# EAGLE design ThermoActuator-v10 (EAGLE 7.1.0)
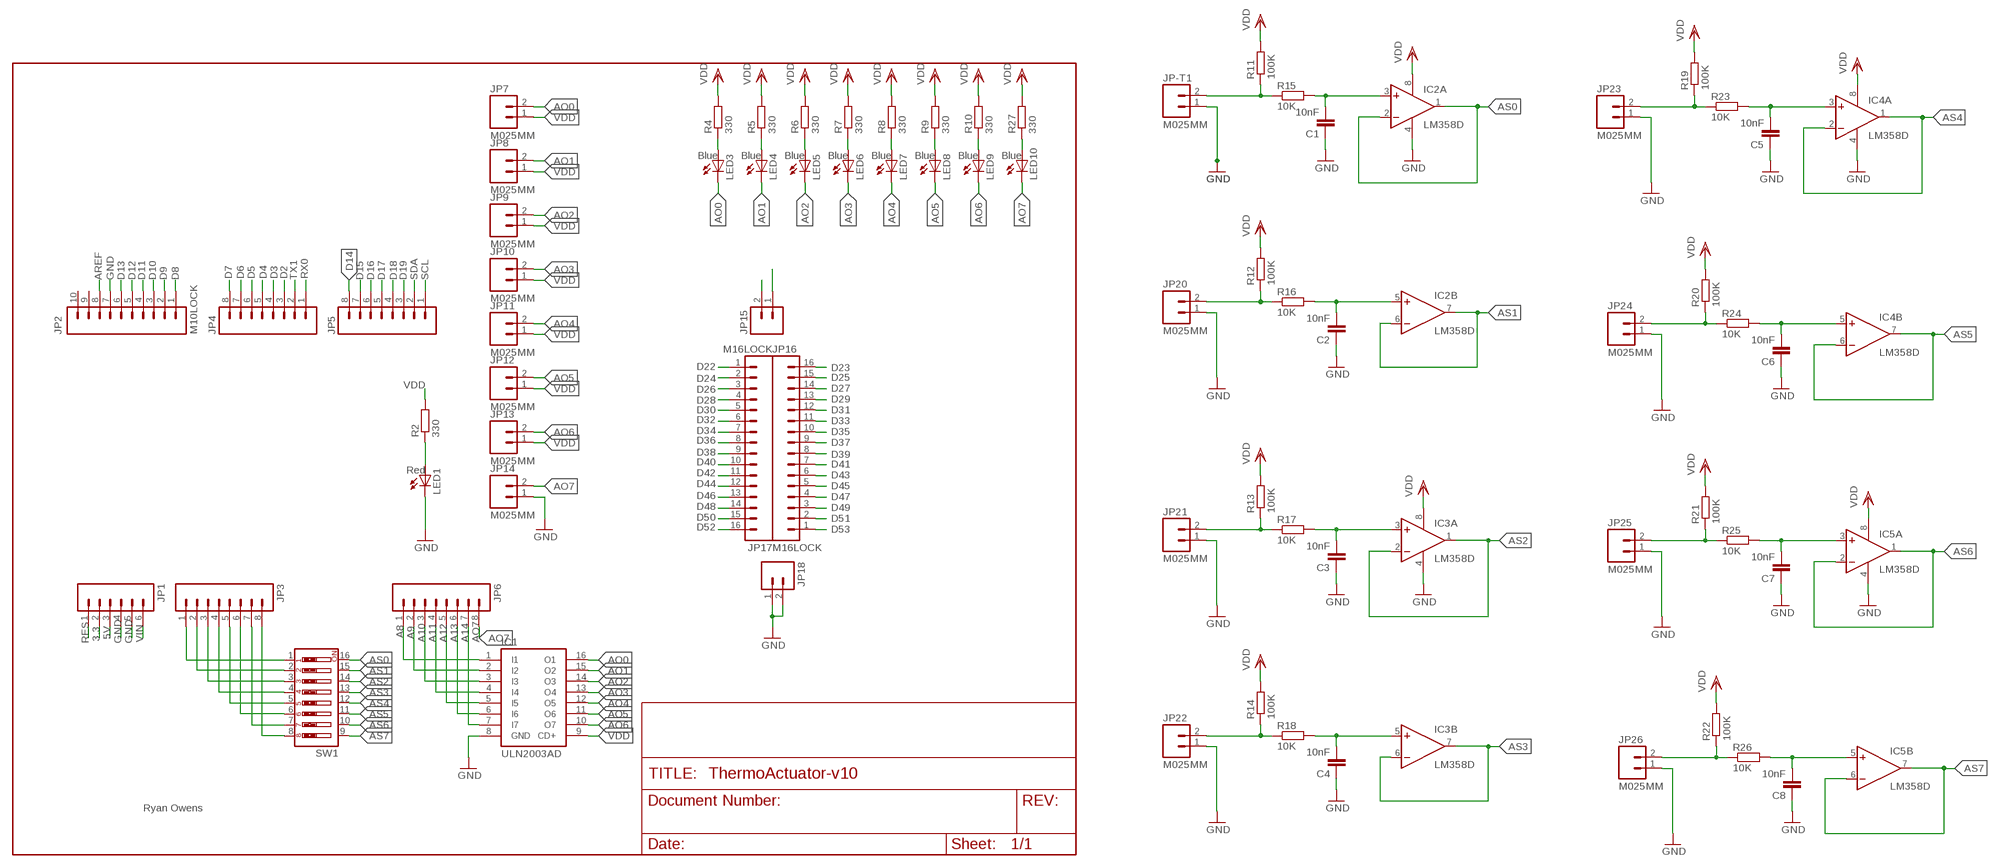
[diagram p0: schematic, sheet 1]

## Parts
C1  10nF  C-EUC1206  [C1206]
C2  10nF  C-EUC1206  [C1206]
C3  10nF  C-EUC1206  [C1206]
C4  10nF  C-EUC1206  [C1206]
C5  10nF  C-EUC1206  [C1206]
C6  10nF  C-EUC1206  [C1206]
C7  10nF  C-EUC1206  [C1206]
C8  10nF  C-EUC1206  [C1206]
IC1  ULN2003AD  [SO16]
IC2  LM358D  [SO08]
IC3  LM358D  [SO08]
IC4  LM358D  [SO08]
IC5  LM358D  [SO08]
JP1  M06LOCK  [1X06_LOCK]
JP2  M10LOCK  [1X10_LOCK]
JP3  M08LOCK  [1X08_LOCK]
JP4  M08LOCK  [1X08_LOCK]
JP5  M08LOCK  [1X08_LOCK]
JP6  M08LOCK  [1X08_LOCK]
JP7  M025MM  [SCREWTERMINAL-5MM-2]
JP8  M025MM  [SCREWTERMINAL-5MM-2]
JP9  M025MM  [SCREWTERMINAL-5MM-2]
JP10  M025MM  [SCREWTERMINAL-5MM-2]
JP11  M025MM  [SCREWTERMINAL-5MM-2]
JP12  M025MM  [SCREWTERMINAL-5MM-2]
JP13  M025MM  [SCREWTERMINAL-5MM-2]
JP14  M025MM  [SCREWTERMINAL-5MM-2]
JP15  M02LOCK  [1X02_LOCK]
JP16  M16LOCK  [1X16_LOCK]
JP17  M16LOCK  [1X16_LOCK]
JP18  M02LOCK  [1X02_LOCK]
JP20  M025MM  [SCREWTERMINAL-5MM-2]
JP21  M025MM  [SCREWTERMINAL-5MM-2]
JP22  M025MM  [SCREWTERMINAL-5MM-2]
JP23  M025MM  [SCREWTERMINAL-5MM-2]
JP24  M025MM  [SCREWTERMINAL-5MM-2]
JP25  M025MM  [SCREWTERMINAL-5MM-2]
JP26  M025MM  [SCREWTERMINAL-5MM-2]
JP-T1  M025MM  [SCREWTERMINAL-5MM-2]
LED1  Red  LEDCHIP-LED0805  [CHIP-LED0805]
LED3  Blue  LEDCHIP-LED0805  [CHIP-LED0805]
LED4  Blue  LEDCHIP-LED0805  [CHIP-LED0805]
LED5  Blue  LEDCHIP-LED0805  [CHIP-LED0805]
LED6  Blue  LEDCHIP-LED0805  [CHIP-LED0805]
LED7  Blue  LEDCHIP-LED0805  [CHIP-LED0805]
LED8  Blue  LEDCHIP-LED0805  [CHIP-LED0805]
LED9  Blue  LEDCHIP-LED0805  [CHIP-LED0805]
LED10  Blue  LEDCHIP-LED0805  [CHIP-LED0805]
R2  330  R-EU_R0805  [R0805]
R4  330  R-EU_R0805  [R0805]
R5  330  R-EU_R0805  [R0805]
R6  330  R-EU_R0805  [R0805]
R7  330  R-EU_R0805  [R0805]
R8  330  R-EU_R0805  [R0805]
R9  330  R-EU_R0805  [R0805]
R10  330  R-EU_R0805  [R0805]
R11  100K  R-EU_R0805  [R0805]
R12  100K  R-EU_R0805  [R0805]
R13  100K  R-EU_R0805  [R0805]
R14  100K  R-EU_R0805  [R0805]
R15  10K  R-EU_R1206  [R1206]
R16  10K  R-EU_R1206  [R1206]
R17  10K  R-EU_R1206  [R1206]
R18  10K  R-EU_R1206  [R1206]
R19  100K  R-EU_R0805  [R0805]
R20  100K  R-EU_R0805  [R0805]
R21  100K  R-EU_R0805  [R0805]
R22  100K  R-EU_R0805  [R0805]
R23  10K  R-EU_R1206  [R1206]
R24  10K  R-EU_R1206  [R1206]
R25  10K  R-EU_R1206  [R1206]
R26  10K  R-EU_R1206  [R1206]
R27  330  R-EU_R0805  [R0805]
SW1  SW_DIP-8  [EDG-08]

## Nets
3.3: JP1.2
5V: JP1.3
A8: IC1.1(I1) JP6.1
A9: IC1.2(I2) JP6.2
A10: IC1.3(I3) JP6.3
A11: IC1.4(I4) JP6.4
A12: IC1.5(I5) JP6.5
A13: IC1.6(I6) JP6.6
A14: IC1.7(I7) JP6.7
AO0: IC1.16(O1) JP7.2 LED3.C
AO1: IC1.15(O2) JP8.2 LED4.C
AO2: IC1.14(O3) JP9.2 LED5.C
AO3: IC1.13(O4) JP10.2 LED6.C
AO4: IC1.12(O5) JP11.2 LED7.C
AO5: IC1.11(O6) JP12.2 LED8.C
AO6: IC1.10(O7) JP13.2 LED9.C
AO7: JP6.8 JP14.2 LED10.C
AREF: JP2.8
AS0: IC2.1(A:OUT) IC2.2(A:-IN) SW1.16
AS1: IC2.6(B:-IN) IC2.7(B:OUT) SW1.15
AS2: IC3.1(A:OUT) IC3.2(A:-IN) SW1.14
AS3: IC3.6(B:-IN) IC3.7(B:OUT) SW1.13
AS4: IC4.1(A:OUT) IC4.2(A:-IN) SW1.12
AS5: IC4.6(B:-IN) IC4.7(B:OUT) SW1.11
AS6: IC5.1(A:OUT) IC5.2(A:-IN) SW1.10
AS7: IC5.6(B:-IN) IC5.7(B:OUT) SW1.9
D2: JP4.3
D3: JP4.4
D4: JP4.5
D5: JP4.6
D6: JP4.7
D7: JP4.8
D8: JP2.1
D9: JP2.2
D10: JP2.3
D11: JP2.4
D12: JP2.5
D13: JP2.6
D14: JP5.8
D15: JP5.7
D16: JP5.6
D17: JP5.5
D18: JP5.4
D19: JP5.3
D22: JP17.1
D23: JP16.16
D24: JP17.2
D25: JP16.15
D26: JP17.3
D27: JP16.14
D28: JP17.4
D29: JP16.13
D30: JP17.5
D31: JP16.12
D32: JP17.6
D33: JP16.11
D34: JP17.7
D35: JP16.10
D36: JP17.8
D37: JP16.9
D38: JP17.9
D39: JP16.8
D40: JP17.10
D41: JP16.7
D42: JP17.11
D43: JP16.6
D44: JP17.12
D45: JP16.5
D46: JP17.13
D47: JP16.4
D48: JP17.14
D49: JP16.3
D50: JP17.15
D51: JP16.2
D52: JP17.16
D53: JP16.1
GND: C1.1 C2.1 C3.1 C4.1 C5.1 C6.1 C7.1 C8.1 IC1.8(GND) IC2.4(P:V-) IC3.4(P:V-) IC4.4(P:V-) IC5.4(P:V-) JP1.4 JP1.5 JP2.7 JP14.1 JP18.1 JP18.2 JP20.1 JP21.1 JP22.1 JP23.1 JP24.1 JP25.1 JP26.1 JP-T1.1 LED1.C
N$1: JP-T1.2 R11.1 R15.1
N$2: C1.2 IC2.3(A:+IN) R15.2
N$3: JP3.1 SW1.1
N$4: JP3.2 SW1.2
N$5: JP3.3 SW1.3
N$6: JP3.4 SW1.4
N$7: JP3.5 SW1.5
N$8: JP3.6 SW1.6
N$9: JP3.7 SW1.7
N$10: JP3.8 SW1.8
N$11: JP20.2 R12.1 R16.1
N$12: C2.2 IC2.5(B:+IN) R16.2
N$13: LED3.A R4.1
N$14: LED4.A R5.1
N$15: LED5.A R6.1
N$16: LED6.A R7.1
N$17: LED7.A R8.1
N$18: LED8.A R9.1
N$19: LED9.A R10.1
N$20: JP21.2 R13.1 R17.1
N$21: C3.2 IC3.3(A:+IN) R17.2
N$22: JP22.2 R14.1 R18.1
N$23: C4.2 IC3.5(B:+IN) R18.2
N$24: JP23.2 R19.1 R23.1
N$25: C5.2 IC4.3(A:+IN) R23.2
N$26: JP24.2 R20.1 R24.1
N$27: C6.2 IC4.5(B:+IN) R24.2
N$28: JP25.2 R21.1 R25.1
N$29: C7.2 IC5.3(A:+IN) R25.2
N$30: JP26.2 R22.1 R26.1
N$31: C8.2 IC5.5(B:+IN) R26.2
N$32: LED10.A R27.1
N$126: LED1.A R2.1
RES: JP1.1
RX0: JP4.1
SCL: JP5.1
SDA: JP5.2
TX1: JP4.2
VDD: IC1.9(CD+) IC2.8(P:V+) IC3.8(P:V+) IC4.8(P:V+) IC5.8(P:V+) JP7.1 JP8.1 JP9.1 JP10.1 JP11.1 JP12.1 JP13.1 JP15.1 JP15.2 R2.2 R4.2 R5.2 R6.2 R7.2 R8.2 R9.2 R10.2 R11.2 R12.2 R13.2 R14.2 R19.2 R20.2 R21.2 R22.2 R27.2
VIN: JP1.6
Unconnected: JP2.9 JP2.10

## Notes on the sheet
- Ryan Owens

## Library data of the parts
C1-C8 = rcl:C-EU: CAPACITOR, European symbol
IC1 = uln-udn:ULN2003A: DRIVER ARRAY
IC2-IC5 = linear:LM358: OP AMP also LM158; LM258; LM2904 Source: http://cache.national.com/ds/LM/LM158.pdf
JP1 = SparkFun:M06: Header 6 Standard 6-pin 0.1" header. Use with straight break away headers (SKU : PRT-00116), right angle break away headers (PRT-00553), swiss pins (PRT-00743), machine pins (PRT-00117), and female headers (PRT-00115). Molex polarized connector foot print use with SKU : PRT-08094 with associated crimp pins and housings. NOTES ON THE VARIANTS LOCK and LOCK_LONGPADS... This footprint was designed to help hold the alignment of a through-hole component (i.e. 6-pin header) while soldering it into place. You may notice that each hole has been shifted either up or down by 0.005 of an inch from it's more standard position (which is a perfectly straight line). This slight alteration caused the pins (the squares in the middle) to touch the edges of the holes. Because they are alternating, it causes a "brace" to hold the component in place. 0.005 has proven to be the perfect amount of "off-center" position when using our standard breakaway headers. Although looks a little odd when you look at the bare footprint, once you have a header in there, the alteration is very hard to notice. Also, if you push a header all the way into place, it is covered up entirely on the bottom side. This idea of altering the position of holes to aid alignment will be further integrated into the Sparkfun Library for other footprints. It can help hold any component with 3 or more connection pins.
JP2 = SparkFun-Connectors:M10: Header 10 Standard 10-pin 0.1" header. Use with straight break away headers (SKU : PRT-00116), right angle break away headers (PRT-00553), swiss pins (PRT-00743), machine pins (PRT-00117), and female headers (PRT-00115).
JP3-JP6 = SparkFun:M08: Header 8 Standard 8-pin 0.1" header. Use with straight break away headers (SKU : PRT-00116), right angle break away headers (PRT-00553), swiss pins (PRT-00743), machine pins (PRT-00117), and female headers (PRT-00115).
JP7-JP14 JP20-JP26 JP-T1 = SparkFun-Connectors:M02: Standard 2-pin 0.1" header. Use with - straight break away headers ( PRT-00116) - right angle break away headers (PRT-00553) - swiss pins (PRT-00743) - machine pins (PRT-00117) - female headers (PRT-00115) Molex polarized connector foot print use with: PRT-08233 with associated crimp pins and housings. 2.54_SCREWTERM for use with PRT-10571. 3.5mm Screw Terminal footprints for PRT-08084 5mm Screw Terminal footprints for use with PRT-08432; STOREFRONT_ID: PRT-08432
JP15 JP18 = SparkFun:M02: Header 2 Standard 2-pin 0.1" header. Use with straight break away headers (SKU : PRT-00116), right angle break away headers (PRT-00553), swiss pins (PRT-00743), machine pins (PRT-00117), and female headers (PRT-00115). Molex polarized connector foot print use with SKU : PRT-08233 with associated crimp pins and housings.
JP16 JP17 = SparkFun:M16
LED1 LED3-LED10 = led:LED: LED OSRAM: - CHIPLED LG R971, LG N971, LY N971, LG Q971, LY Q971, LO R971, LY R971 LH N974, LH R974 LS Q976, LO Q976, LY Q976 LO Q996 - Hyper CHIPLED LW Q18S LB Q993, LB Q99A, LB R99A - SideLED LS A670, LO A670, LY A670, LG A670, LP A670 LB A673, LV A673, LT A673, LW A673 LH A674 LY A675 LS A676, LA A676, LO A676, LY A676, LW A676 LS A679, LY A679, LG A679 - Hyper Micro SIDELED® LS Y876, LA Y876, LO Y876, LY Y876 LT Y87S - SmartLED LW L88C, LW L88S LB L89C, LB L89S, LG L890 LS L89K, LO L89K, LY L89K LS L896, LA L896, LO L896, LY L896 - TOPLED LS T670, LO T670, LY T670, LG T670, LP T670 LSG T670, LSP T670, LSY T670, LOP T670, LYG T670 LG T671, LOG T671, LSG T671 LB T673, LV T673, LT T673, LW T673 LH T674 LS T676, LA T676, LO T676, LY T676, LB T676, LH T676, LSB T676, LW T676 LB T67C, LV T67C, LT T67C, LS T67K, LO T67K, LY T67K, LW E67C LS E67B, LA E67B, LO E67B, LY E67B, LB E67C, LV E67C, LT E67C LW T67C LS T679, LY T679, LG T679 LS T770, LO T770, LY T770, LG T770, LP T770 LB T773, LV T773, LT T773, LW T773 LH T774 LS E675, LA E675, LY E675, LS T675 LS T776, LA T776, LO T776, LY T776, LB T776 LHGB T686 LT T68C, LB T68C - Hyper Mini TOPLED® LB M676 - Mini TOPLED Santana® LG M470 LS M47K, LO M47K, LY M47K Source: http://www.osram.convergy.de LUXEON: - LUMILED® LXK2-PW12-R00, LXK2-PW12-S00, LXK2-PW14-U00, LXK2-PW14-V00 LXK2-PM12-R00, LXK2-PM12-S00, LXK2-PM14-U00 LXK2-PE12-Q00, LXK2-PE12-R00, LXK2-PE12-S00, LXK2-PE14-T00, LXK2-PE14-U00 LXK2-PB12-K00, LXK2-PB12-L00, LXK2-PB12-M00, LXK2-PB14-N00, LXK2-PB14-P00, LXK2-PB14-Q00 LXK2-PR12-L00, LXK2-PR12-M00, LXK2-PR14-Q00, LXK2-PR14-R00 LXK2-PD12-Q00, LXK2-PD12-R00, LXK2-PD12-S00 LXK2-PH12-R00, LXK2-PH12-S00 LXK2-PL12-P00, LXK2-PL12-Q00, LXK2-PL12-R00 Source: www.luxeon.com KINGBRIGHT: KA-3528ASYC Source: www.kingbright.com
R2 R4-R27 = rcl:R-EU_: RESISTOR, European symbol
SW1 = special:SW_DIP-8: DIP SWITCH

## Board
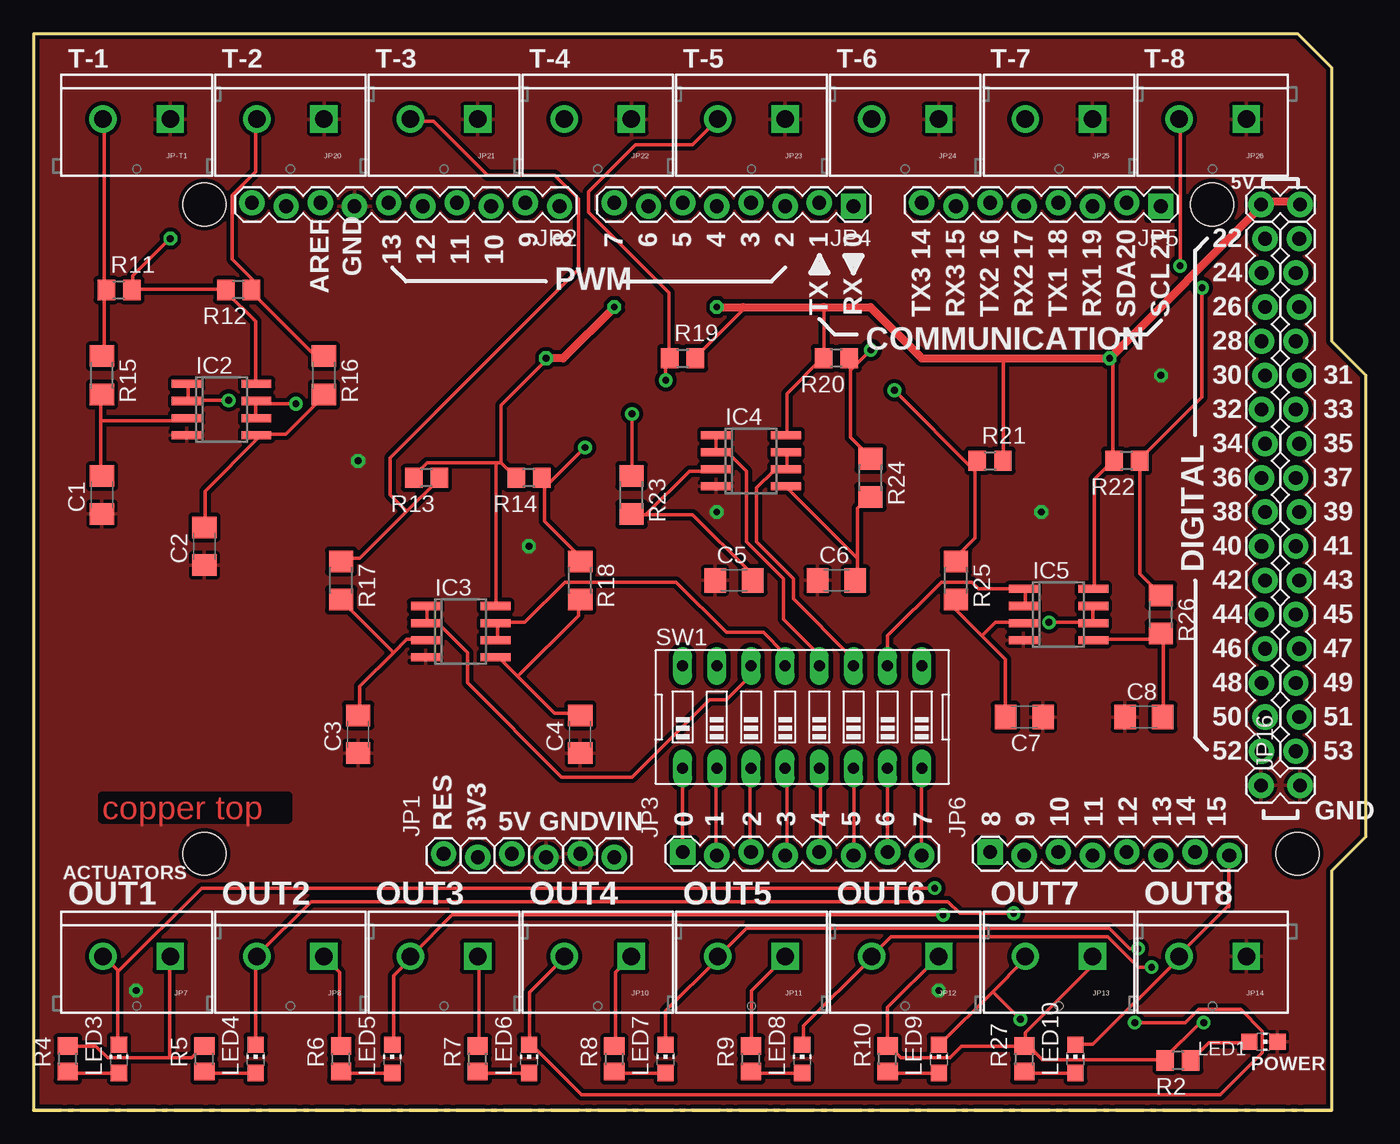
[diagram p1: board, top side]
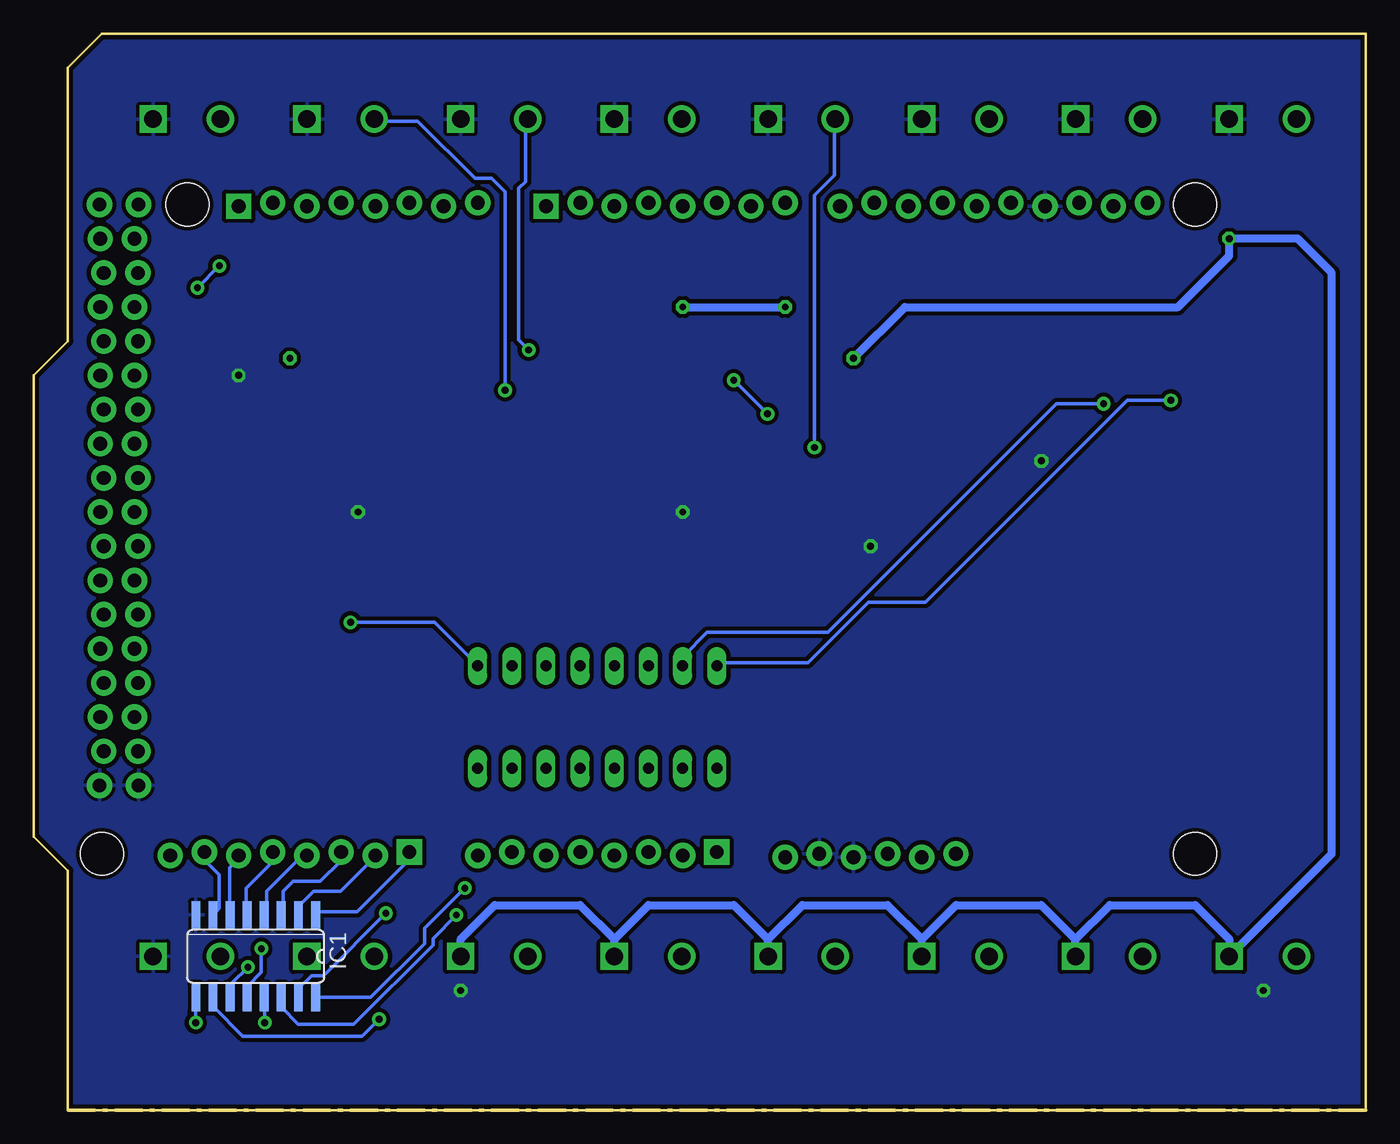
[diagram p2: board, bottom side, seen from below]

Size 99.06 x 80.01 mm. Coordinates in mm from the lower left corner, seen from the top.
Outline: 0,0 96.52,0
Outline: 96.52,0 96.52,17.78 99.06,20.32 99.06,54.61 96.52,57.15 96.52,77.47 93.98,80.01 0,80.01 0,0
Outline: 0,0 96.52,0
Copper layers (1*16): Top 0.035mm / dielectric 1.5mm / Bottom 0.035mm
Design rules "SparkFun *": minimum track width 10mil, minimum drill 20mil, track to track 10mil, track to pad 10mil, pad to pad 10mil, via to via 10mil, smd to smd 10mil, copper to edge 12mil, drill to drill 10mil, minimum pad ring 12mil, minimum via ring 10mil, stop-mask expansion 4mil, vias tented up to drill 25mil, thermal gap 10mil
Holes 3.2 mm at 12.7,67.31 12.7,19.05 87.63,67.31 93.98,19.05

### Footprints (pad centres in the part's own frame; a part is rotated, then mirrored left to right if it is on the bottom)
C1206 = smd 1.6 x 1.8: 1 -1.4,0; 2 1.4,0
SO16 = smd 0.66 x 2.032: 1 -4.445,-3.073; 2 -3.175,-3.073; 3 -1.905,-3.073; 4 -0.635,-3.073; 5 0.635,-3.073; 6 1.905,-3.073; 7 3.175,-3.073; 8 4.445,-3.073; 9 4.445,3.073; 10 3.175,3.073; 11 1.905,3.073; 12 0.635,3.073; 13 -0.635,3.073; 14 -1.905,3.073; 15 -3.175,3.073; 16 -4.445,3.073
SO08 = smd 0.6 x 2.2: 1 -1.905,-2.6; 2 -0.635,-2.6; 3 0.635,-2.6; 4 1.905,-2.6; 5 1.905,2.6; 6 0.635,2.6; 7 -0.635,2.6; 8 -1.905,2.6
1X06_LOCK = drill 1.016 pad 1.88: 1 0,0; 2 2.54,-0.254; 3 5.08,0; 4 7.62,-0.254; 5 10.16,0; 6 12.7,-0.254
1X10_LOCK = drill 1.016 pad 1.88: 1 0,0.127; 2 2.54,-0.127; 3 5.08,0.127; 4 7.62,-0.127; 5 10.16,0.127; 6 12.7,-0.127; 7 15.24,0.127; 8 17.78,-0.127; 9 20.32,0.127; 10 22.86,-0.127
1X08_LOCK = drill 1.016 pad 1.88 square: 1 0,0.127 | drill 1.016 pad 1.88: 2 2.54,-0.127; 3 5.08,0.127; 4 7.62,-0.127; 5 10.16,0.127; 6 12.7,-0.127; 7 15.24,0.127; 8 17.78,-0.127
SCREWTERMINAL-5MM-2 = drill 1.3 pad 2.032 square: 1 0,0 | drill 1.3 pad 2.032: 2 5,0
1X02_LOCK = drill 1.016 pad 1.88: 1 -0.178,0; 2 2.718,0
1X16_LOCK = drill 1.016 pad 1.88: 1 0,0.127; 2 2.54,-0.127; 3 5.08,0.127; 4 7.62,-0.127; 5 10.16,0.127; 6 12.7,-0.127; 7 15.24,0.127; 8 17.78,-0.127; 9 20.32,0.127; 10 22.86,-0.127; 11 25.4,0.127; 12 27.94,-0.127; 13 30.48,0.127; 14 33.02,-0.127; 15 35.56,0.127; 16 38.1,-0.127
CHIP-LED0805 = smd 1.2 x 1.2: A 0,-1.05; C 0,1.05
R0805 = smd 1.3 x 1.5: 1 -0.95,0; 2 0.95,0
R1206 = smd 1.6 x 1.803: 1 -1.422,0; 2 1.422,0
EDG-08 = drill 0.813 long: 1 -8.89,-3.81; 2 -6.35,-3.81; 3 -3.81,-3.81; 4 -1.27,-3.81; 5 1.27,-3.81; 6 3.81,-3.81; 7 6.35,-3.81; 8 8.89,-3.81; 9 8.89,3.81; 10 6.35,3.81; 11 3.81,3.81; 12 1.27,3.81; 13 -1.27,3.81; 14 -3.81,3.81; 15 -6.35,3.81; 16 -8.89,3.81

### Placement (x,y rotation side)
C1  5.08,45.72 90 top
C2  12.7,41.91 90 top
C3  24.13,27.94 90 top
C4  40.64,27.94 90 top
C5  52.07,39.37 0 top
C6  59.69,39.37 0 top
C7  73.66,29.21 180 top
C8  82.55,29.21 0 top
IC1  82.55,11.43 180 bottom
IC2  13.97,52.07 270 top
IC3  31.75,35.56 270 top
IC4  53.34,48.26 270 top
IC5  76.2,36.83 270 top
JP1  30.48,19.05 0 top
JP2  39.1,67.31 180 top
JP3  48.26,19.05 0 top
JP4  60.96,67.31 180 top
JP5  83.82,67.31 180 top
JP6  71.12,19.05 0 top
JP7  10.16,11.43 180 top
JP8  21.59,11.43 180 top
JP9  33.02,11.43 180 top
JP10  44.45,11.43 180 top
JP11  55.88,11.43 180 top
JP12  67.31,11.43 180 top
JP13  78.74,11.43 180 top
JP14  90.17,11.43 180 top
JP15  91.44,67.31 0 top
JP16  93.98,26.67 90 top
JP17  91.44,26.67 90 top
JP18  91.44,24.13 0 top
JP20  21.59,73.66 180 top
JP21  33.02,73.66 180 top
JP22  44.45,73.66 180 top
JP23  55.88,73.66 180 top
JP24  67.31,73.66 180 top
JP25  78.74,73.66 180 top
JP26  90.17,73.66 180 top
JP-T1  10.16,73.66 180 top
LED1  91.44,5.08 270 top
LED3  6.35,3.81 0 top
LED4  16.51,3.81 0 top
LED5  26.67,3.81 0 top
LED6  36.83,3.81 0 top
LED7  46.99,3.81 0 top
LED8  57.15,3.81 0 top
LED9  67.31,3.81 0 top
LED10  77.47,3.81 0 top
R2  85.09,3.68 180 top
R4  2.54,3.81 90 top
R5  12.7,3.81 90 top
R6  22.86,3.81 90 top
R7  33.02,3.81 90 top
R8  43.18,3.81 90 top
R9  53.34,3.81 90 top
R10  63.5,3.81 90 top
R11  6.35,60.96 0 top
R12  15.24,60.96 180 top
R13  29.21,46.99 180 top
R14  36.83,46.99 180 top
R15  5.08,54.61 270 top
R16  21.59,54.61 270 top
R17  22.86,39.37 270 top
R18  40.64,39.37 270 top
R19  48.26,55.88 0 top
R20  59.69,55.88 180 top
R21  71.12,48.26 0 top
R22  81.28,48.26 180 top
R23  44.45,45.72 270 top
R24  62.23,46.99 270 top
R25  68.58,39.37 270 top
R26  83.82,36.83 270 top
R27  73.66,3.81 90 top
SW1  57.15,29.21 0 top

### Tracks (layer width: path | path; a pad name or v marks a point on that pad's centre or on a via)
A8
  Bottom 0.254: IC1.1 78,14.75 75,14.75 71.25,18.5 71.25,19 JP6.1
A9
  Bottom 0.254: IC1.2 79.25,14.75 79.25,15.25 78.25,16.25 76.25,16.25 73.75,18.75 JP6.2
A10
  Bottom 0.254: IC1.3 80.5,14.75 80.5,16.25 79.75,17 77.75,17 76.25,18.5 76.25,19 JP6.3
A11
  Bottom 0.254: IC1.4 81.75,14.75 81.75,16.25 79.25,18.75 78.75,18.75 JP6.4
A12
  Bottom 0.254: IC1.5 83.25,14.75 83.25,16.5 81.5,18.25 81.5,19 JP6.5
A13
  Bottom 0.254: IC1.6 84.5,14.75 84.5,18 83.75,18.75 JP6.6
A14
  Bottom 0.254: IC1.7 85.5,14.75 85.25,15 85.25,17.5 86.25,18.5 86.25,19 JP6.7
AO0  (via drill 0.51)
  Top 0.254: 6.25,10.38 6.25,4.88 LED3.C | 6.25,10.38 5.25,11.38 JP7.2 | v67,16.5 12.5,16.5 6.38,10.38 6.25,10.38
  Bottom 0.254: v67,16.5 70,13.5 70,12.38 74,8.38 78,8.38 IC1.16
AO1  (via drill 0.51)
  Top 0.254: 16.5,11.38 JP8.2 | LED4.C 16.5,4.88 16.5,11.25 JP8.2 | v72.88,14.62 68.88,14.62 68,15.5 20.62,15.5 16.62,11.5 JP8.2
  Bottom 0.254: IC1.15 79.38,9 78.38,10 77.5,10 v72.88,14.62
AO2  (via drill 0.51)
  Top 0.254: 28,11.38 JP9.2 | LED5.C 26.75,4.88 26.75,10 28,11.25 JP9.2 | v67.62,14.5 31.12,14.5 28.12,11.5 JP9.2
  Bottom 0.254: v67.62,14.5 69.38,12.75 69.38,12.25 75.25,6.38 79.38,6.38 80.62,7.62 80.62,8.25 IC1.14
AO3  (via drill 0.51)
  Top 0.254: 39.38,11.38 JP10.2 39.38,11.25 36.88,8.75 36.88,4.88 LED6.C 37,4.88 40.75,1.12 88.25,1.12 91.38,4.25 91.38,5.88 89.75,7.5 86.62,7.5 85.62,6.5 v81.88,6.5
  Bottom 0.254: v81.88,6.5 81.88,8.25 IC1.13
AO4  (via drill 0.51)
  Top 0.254: 50.88,11.38 JP11.2 | LED7.C 47,4.88 47,7.38 50.88,11.25 JP11.2 | v82.12,12 81.5,12 80,13.5 53,13.5 51,11.5 JP11.2
  Bottom 0.254: v82.12,12 82.12,10.25 83.12,9.25 83.12,8.38 IC1.12
AO5  (via drill 0.51)
  Top 0.254: 62.25,11.38 JP12.2 | LED8.C 57.25,4.88 57.25,6.25 62.25,11.25 JP12.2 | v83.12,10.62 82.12,10.62 79.88,12.88 63.75,12.88 62.38,11.5 JP12.2
  Bottom 0.254: v83.12,10.62 84.38,9.38 84.38,8.38 IC1.11
AO6  (via drill 0.51)
  Top 0.254: 73.62,11.38 JP13.2 73.62,11.25 73.62,11.12 71.31,8.81 | 71.31,8.81 67.38,4.88 LED9.C | 71.31,8.81 v73.38,6.75
  Bottom 0.254: v73.38,6.75 74.62,5.5 83.5,5.5 85.62,7.62 85.62,8.25 IC1.10
AO7
  Top 0.254: JP6.8 88.88,18.88 88.88,15.12 88.75,15.12 85.25,11.62 JP14.2 | 85.25,11.5 JP14.2 | LED10.C 77.5,4.88 78.75,4.88 85.25,11.38 JP14.2
AS0  (via drill 0.51)
  Top 0.254: 11.5,52.75 11.5,53.75 IC2.1 | v14.5,52.75 11.5,52.75 | 11.5,52.75 IC2.2
  Bottom 0.254: v14.5,52.75 17.75,52.75 32.75,37.75 37,37.75 41.5,33.25 48.25,33.25 SW1.16
AS1  (via drill 0.51)
  Top 0.254: IC2.6 16.5,51.5 16.5,52.5 IC2.7 16.75,52.5 v19.5,52.5
  Bottom 0.254: v19.5,52.5 23,52.5 40,35.5 49,35.5 50.75,33.75 50.75,33.25 SW1.15
AS2
  Top 0.254: IC3.1 29.25,37.25 29.25,36.25 IC3.2 29.25,36 30.25,36 32.25,34 32.25,31.75 39.25,24.75 44.5,24.75 50.25,30.5 51.5,30.5 53.25,32.25 53.25,33 SW1.14
AS3
  Top 0.254: IC3.6 34.5,35 34.5,36 IC3.7 34.5,36.25 36.5,36.25 39.5,39.25 47.75,39.25 51.5,35.5 54.25,35.5 55.75,34 55.75,33.25 SW1.13
AS4
  Top 0.254: IC4.1 50.75,50 50.75,49 IC4.2 50.75,48.75 51.75,48.75 53,47.5 53,42.25 55.75,39.5 55.75,36.5 58.25,34 58.25,33.25 SW1.12
AS5
  Top 0.254: IC4.7 56,48.75 56,47.75 IC4.6 55.75,47.5 55,47.5 53.75,46.25 53.75,42.25 56.5,39.5 56.5,38 60.75,33.75 60.75,33.25 SW1.11
AS6
  Top 0.254: IC5.2 73.75,37.5 73.75,38.5 IC5.1 73.5,38.75 70.25,38.75 69.75,39.25 67.5,39.25 63.5,35.25 SW1.10
AS7  (via drill 0.51)
  Top 0.254: 78.75,36.25 78.75,37.25 IC5.7 | v75.5,36.25 78.75,36.25 | 78.75,36.25 IC5.6
  Bottom 0.254: v75.5,36.25 69.25,36.25 66.25,33.25 SW1.9
GND  (via drill 0.5)
  other vias: 24.13,48.26 74.93,44.45 83.82,54.61 36.83,41.91 7.62,8.89 67.31,8.89 50.8,44.45
  pour Bottom (isolate 0.305): 0,0 96.52,0 96.52,17.78 99.06,20.32 99.06,54.61 96.52,57.15 96.52,77.47 93.98,80.01 0,80.01
  pour Top (isolate 0.305): 0,0 96.52,0 96.52,17.78 99.06,20.32 99.06,54.61 96.52,57.15 96.52,77.47 93.98,80.01 0,80.01
N$1
  Top 0.254: R15.1 5.25,56.25 5.25,60.75 R11.1 5.25,61 5.25,73.5 JP-T1.2
N$2
  Top 0.254: 5,51.25 5,53 R15.2 | 5,51.25 5,47.25 C1.2 | 5,51.25 11.25,51.25 IC2.3
N$3
  Top 0.254: SW1.1 48.25,25.25 48.25,19.25 JP3.1
N$4
  Top 0.254: SW1.2 50.75,25.25 50.75,19 JP3.2
N$5
  Top 0.254: SW1.3 53.25,25.25 53.25,19.25 JP3.3
N$6
  Top 0.254: SW1.4 56,25.25 56,19 JP3.4
N$7
  Top 0.254: SW1.5 58.5,25.25 58.5,19.25 JP3.5
N$8
  Top 0.254: SW1.6 61,25.25 61,19 JP3.6
N$9
  Top 0.254: JP3.7 SW1.7
N$10
  Top 0.254: SW1.8 66,25.25 66,19 JP3.8
N$11
  Top 0.254: R16.1 21.5,56.25 20.75,56.25 16.25,60.75 R12.1 16.25,61 16.25,61.75 14.75,63.25 14.75,68 16.5,69.75 16.5,73.5 JP20.2
N$12
  Top 0.254: C2.2 12.75,43.5 12.75,46 16.75,50 IC2.5 16.75,50.25 18.75,50.25 21.5,53 R16.2
N$13
  Top 0.254: LED3.A 6.25,2.75 2.62,2.75 R4.1
N$14
  Top 0.254: LED4.A 12.75,2.75 R5.1
N$15
  Top 0.254: LED5.A 26.62,2.75 22.88,2.75 R6.1
N$16
  Top 0.254: LED6.A 36.75,2.75 33.12,2.75 R7.1
N$17
  Top 0.254: LED7.A 46.88,2.75 43.25,2.75 R8.1
N$18
  Top 0.254: LED8.A 57.12,2.75 53.38,2.75 R9.1
N$19
  Top 0.254: LED9.A 67.25,2.75 63.5,2.75 R10.1
N$20
  Top 0.254: 27.75,44.5 24.25,41 23,41 R17.1 | 27.75,44.5 30,46.75 R13.1 | 27.75,44.5 26.5,45.75 26.5,48.5 40.5,62.5 40.5,67.75 38.75,69.5 33.75,69.5 29.75,73.5 28.25,73.5 JP21.2
N$21
  Top 0.254: 26.75,34 27.75,35 29,35 IC3.3 | 26.75,34 24.25,31.5 24.25,29.5 C3.2 | 26.75,34 23,37.75 R17.2
N$22  (via drill 0.51)
  Top 0.254: 38,46.25 38,43.75 40.75,41 R18.1 | 38,46.25 38,46.75 R14.1 38,46.25 | 38,46.25 v41,49.25
  Bottom 0.254: v41,49.25 41,68 39.5,69.5 39.5,73.5 JP22.2
N$23
  Top 0.254: 36,32.25 34.5,33.75 IC3.5 | 36,32.25 38.75,29.5 40.5,29.5 C4.2 | 36,32.25 40.5,36.75 40.5,37.75 R18.2
N$24  (via drill 0.51)
  Top 0.254: JP23.2 50.75,73.5 49,71.75 44.75,71.75 41.25,68.25 41.25,66.75 47.25,60.75 47.25,56 R19.1 47.25,55.75 47,55.5 v47,54.25 | v44.5,51.75 44.5,47.25 R23.1
  Bottom 0.254: v47,54.25 v44.5,51.75
N$25
  Top 0.254: 45.5,44.25 44.5,44.25 R23.2 | 45.5,44.25 49,44.25 53.25,40 53.25,39.5 C5.2 | 45.5,44.25 48.75,47.5 50.5,47.5 IC4.3
N$26  (via drill 0.51)
  Top 0.254: 60.75,55 60.75,50 62.25,48.5 R24.1 | 60.75,55 60.75,55.75 R20.1 | 60.75,55 v62.25,56.5
  Bottom 0.254: v62.25,56.5 63,57.25 63,68.5 62.5,69 62.5,73.5 JP24.2
N$27
  Top 0.254: 61.25,41 61.25,44.75 62,45.5 R24.2 | 61.25,41 61.25,39.5 C6.2 | 61.25,41 56,46.25 IC4.5
N$28  (via drill 0.51)
  Top 0.254: 70,47.5 70,42.5 68.5,41 R25.1 | 70,47.5 70,48.25 R21.1 | 70,47.5 v64,53.5
  Bottom 0.254: v64,53.5 64,68.25 65,69.25 66.25,69.25 70.5,73.5 73.5,73.5 JP25.2
N$29
  Top 0.254: 70.5,35.25 68.5,37.25 68.5,37.75 R25.2 | 70.5,35.25 72.25,33.5 72.25,29.25 C7.2 | 70.5,35.25 71.5,36.25 73.5,36.25 IC5.3
N$30  (via drill 0.51)
  Top 0.254: R26.1 83.75,38.38 82.25,39.88 82.25,48.25 R22.1 82.25,48.38 86.88,53 v86.88,61.12 | v85.25,62.75 85.25,73.62 JP26.2
  Bottom 0.254: v86.88,61.12 v85.25,62.75
N$31
  Top 0.254: 84,35 84,35.25 R26.2 84,35 | 84,35 84,29.25 C8.2 | 84,35 79,35 IC5.5
N$32
  Top 0.254: LED10.A 77.38,2.75 73.75,2.75 R27.1
N$126
  Top 0.254: LED1.A 90.38,5 87.38,5 86.12,3.75 R2.1
VDD  (via drill 0.5, 0.51)
  Top 0.254: 10.25,11.5 JP7.1 10.12,11.38 10.12,3.88 | 91.5,67.5 JP15.1 | 94,67.5 JP15.2 | 34.75,48.12 34.38,48.12 | 34.38,48.12 29.25,48.12 28.38,47.25 28.38,47 R13.2 | 34.75,48.12 R14.2 | 34.38,37.5 IC3.8 34.38,37.62 34.38,48.12 | v10.16,64.77 10.12,64.75 7.38,62 7.38,61 R11.2 7.5,61 14.25,61 R12.2 14.25,60.88 16.5,58.62 16.5,54 IC2.8 | R19.2 49.25,56 52.75,59.5 52.75,59.69 | 58.75,59.69 58.75,56 R20.2 58.62,55.88 56,53.25 56,50.25 IC4.8 | 72.12,55.88 72.12,48.38 R21.2 | v80.01,55.88 80.25,55.75 80.25,48.38 R22.2 80.25,48.25 78.88,46.88 78.88,38.75 IC5.8 | 34.75,48.12 34.75,52.38 38,55.62 v38.1,55.88 | R27.2 73.75,4.88 73.75,5.75 78.62,10.62 78.62,11.38 JP13.1 | R27.2 73.88,4.88 75,3.75 84.12,3.75 R2.2 84.12,3.88 86.75,6.5 v87,6.5 | 10.12,3.88 11.75,3.88 12.62,4.75 R5.2 | 10.12,3.88 5.5,3.88 4.62,4.75 2.62,4.75 R4.2 | R6.2 22.75,4.88 22.75,10.25 21.62,11.38 JP8.1 | R7.2 33.12,4.88 33.12,11.38 JP9.1 | R8.2 43.25,4.88 43.25,10.25 44.38,11.38 JP10.1 | R9.2 53.38,4.88 53.38,8.88 55.88,11.38 JP11.1 | JP12.1 67.25,11.38 63.5,7.62 R10.2 63.62,4.75 64.5,3.88 68.12,3.88 69,4.75 73.62,4.75 R27.2
  Top 0.61: 94,67.5 91.5,67.5 | JP15.1 91.44,67.31 v80.01,55.88 72.12,55.88 66.04,55.88 62.23,59.69 58.75,59.69 52.75,59.69 v50.8,59.69 | v43.18,59.69 39.37,55.88 v38.1,55.88
  Bottom 0.254: v87,6.5 87,8.25 IC1.9
  Bottom 0.61: v50.8,59.69 v43.18,59.69 | v38.1,55.88 34.29,59.69 13.97,59.69 10.16,63.5 v10.16,64.77 5.08,64.77 2.54,62.23 2.54,19.05 JP7.1 10.16,12.7 12.7,15.24 19.05,15.24 21.59,12.7 | JP8.1 21.59,12.7 | JP9.1 33.02,12.7 | 33.02,12.7 30.48,15.24 24.13,15.24 21.59,12.7 | JP10.1 44.45,12.7 | 44.45,12.7 41.91,15.24 35.56,15.24 33.02,12.7 | JP11.1 55.88,12.7 | 55.88,12.7 53.34,15.24 46.99,15.24 44.45,12.7 | JP12.1 67.31,12.7 64.77,15.24 58.42,15.24 55.88,12.7

### Text on the board
Top: copper top
tPlace: 5V | 9 | 8 | 7 | 6 | 5 | 4 | 3 | 2 | 1 | 0 | 22 | 13 | 12 | 11 | 10 | 14 | 15 | 16 | 17 | 18 | 19 | 20 | 21 | GND | 24 | AREF | PWM | TX | RX | TX3 | RX3 | TX2 | RX2 | TX1 | RX1 | SDA | SCL | 26 | COMMUNICATION | 28 | 30 | 31 | 32 | 33 | 34 | 35 | 36 | 37 | 38 | 39 | 40 | 41 | DIGITAL | 42 | 43 | 44 | 45 | 46 | 47 | 48 | 49 | 50 | 51 | 52 | 53 | GND | RES | 3V3 | 5V | GND | VIN | 0 | 1 | 2 | 3 | 4 | 5 | 6 | 7 | 8 | 9 | 10 | 11 | 12 | 13 | 14 | 15 | ACTUATORS | POWER
tNames: T-1 | T-2 | T-3 | T-4 | T-5 | T-6 | T-7 | T-8 | OUT1 | OUT2 | OUT3 | OUT4 | OUT5 | OUT6 | OUT7 | OUT8